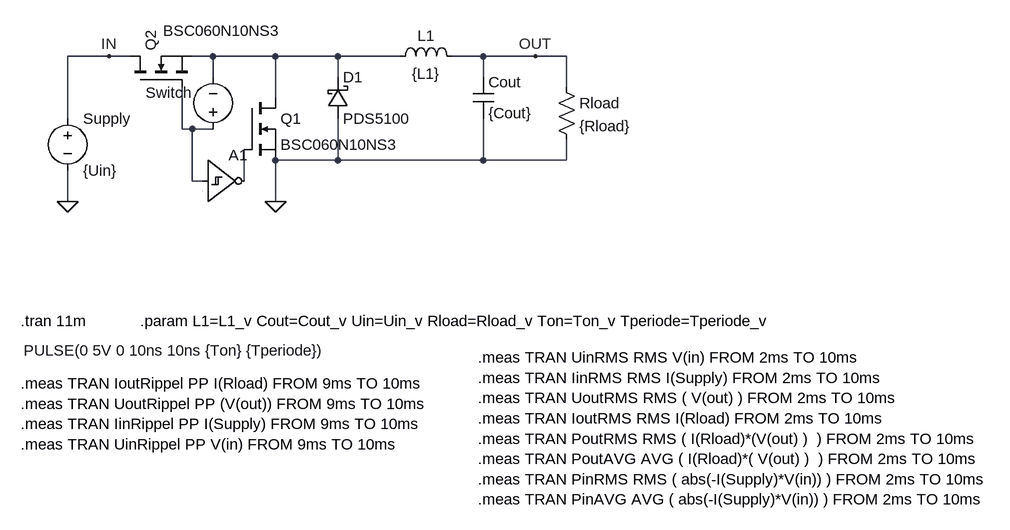
[diagram p0: schematic BuckSyncVariable.asc]
BuckSyncVariable.asc, the LTspice schematic file:
Version 4
SHEET 1 2836 1464
WIRE 400 368 336 368
WIRE 432 368 400 368
WIRE 560 368 528 368
WIRE 656 368 560 368
WIRE 752 368 656 368
WIRE 848 368 752 368
WIRE 976 368 928 368
WIRE 1056 368 976 368
WIRE 1104 368 1056 368
WIRE 560 400 560 368
WIRE 752 400 752 368
WIRE 976 400 976 368
WIRE 1104 416 1104 368
WIRE 656 432 656 368
WIRE 336 464 336 368
WIRE 512 480 512 416
WIRE 528 480 512 480
WIRE 560 480 528 480
WIRE 752 528 752 464
WIRE 752 528 656 528
WIRE 976 528 976 464
WIRE 976 528 752 528
WIRE 1104 528 1104 496
WIRE 1104 528 976 528
WIRE 528 560 528 480
WIRE 544 560 528 560
WIRE 608 560 608 512
WIRE 336 592 336 544
WIRE 656 592 656 528
FLAG 1056 368 OUT
FLAG 400 368 IN
FLAG 656 592 0
FLAG 336 592 0
SYMBOL nmos 608 432 R0
SYMATTR InstName Q1
SYMATTR Value BSC060N10NS3
SYMBOL ind 832 384 R270
WINDOW 0 32 56 VTop 2
WINDOW 3 5 56 VBottom 2
SYMATTR InstName L1
SYMATTR Value {L1}
SYMATTR SpiceLine Ipk=16.7 Rser=0.0187 Rpar=3108.6 Cpar=0
SYMBOL schottky 736 464 M180
WINDOW 0 24 64 Left 2
WINDOW 3 24 0 Left 2
SYMATTR InstName D1
SYMATTR Value PDS5100
SYMATTR Description Diode
SYMATTR Type diode
SYMBOL cap 960 400 R0
SYMATTR SpiceLine Rser=0.004
SYMATTR Value {Cout}
SYMATTR InstName Cout
SYMBOL res 1088 400 R0
SYMATTR InstName Rload
SYMATTR Value {Rload}
SYMBOL voltage 336 448 R0
WINDOW 123 0 0 Left 2
WINDOW 39 0 0 Left 2
SYMATTR InstName Supply
SYMATTR Value {Uin}
SYMBOL voltage 560 496 R180
WINDOW 123 0 0 Left 2
WINDOW 39 0 0 Left 2
WINDOW 3 -176 -325 Left 2
WINDOW 0 33 72 Left 2
SYMATTR Value PULSE(0 5V 0 10ns 10ns {Ton} {Tperiode})
SYMATTR InstName Switch
SYMBOL nmos 432 416 R270
WINDOW 3 87 51 VRight 2
SYMATTR Value BSC060N10NS3
SYMATTR InstName Q2
SYMBOL Digital\\schmtinv 544 496 R0
SYMATTR InstName A1
TEXT 968 832 Left 2 !.meas TRAN UinRMS RMS V(in) FROM 2ms TO 10ms\n.meas TRAN IinRMS RMS I(Supply) FROM 2ms TO 10ms\n.meas TRAN UoutRMS RMS ( V(out) ) FROM 2ms TO 10ms\n.meas TRAN IoutRMS RMS I(Rload) FROM 2ms TO 10ms\n.meas TRAN PoutRMS RMS ( I(Rload)*(V(out) )  ) FROM 2ms TO 10ms\n.meas TRAN PoutAVG AVG ( I(Rload)*( V(out) )  ) FROM 2ms TO 10ms\n.meas TRAN PinRMS RMS ( abs(-I(Supply)*V(in)) ) FROM 2ms TO 10ms\n.meas TRAN PinAVG AVG ( abs(-I(Supply)*V(in)) ) FROM 2ms TO 10ms
TEXT 264 872 Left 2 !.meas TRAN IoutRippel PP I(Rload) FROM 9ms TO 10ms\n.meas TRAN UoutRippel PP (V(out)) FROM 9ms TO 10ms\n.meas TRAN IinRippel PP I(Supply) FROM 9ms TO 10ms\n.meas TRAN UinRippel PP V(in) FROM 9ms TO 10ms
TEXT 448 776 Left 2 !.param L1=L1_v Cout=Cout_v Uin=Uin_v Rload=Rload_v Ton=Ton_v Tperiode=Tperiode_v
TEXT 264 776 Left 2 !.tran 11m

The netlist it stands for:
* BuckSyncVariable.asc
M§Q1 N001 N003 0 0 BSC060N10NS3
L1 N001 OUT {L1} Ipk=16.7 Rser=0.0187 Rpar=3108.6 Cpar=0
D1 0 N001 PDS5100
Cout OUT 0 {Cout} Rser=0.004
Rload OUT 0 {Rload}
V§Supply IN 0 {Uin}
V§Switch N002 N001 PULSE(0 5V 0 10ns 10ns {Ton} {Tperiode})
M§Q2 IN N002 N001 N001 BSC060N10NS3
A1 N002 0 0 0 0 N003 0 0 SCHMITT
.model D D
.lib standard.dio
.model NMOS NMOS
.model PMOS PMOS
.lib standard.mos
.meas TRAN UinRMS RMS V(in) FROM 2ms TO 10ms
.meas TRAN IinRMS RMS I(Supply) FROM 2ms TO 10ms
.meas TRAN UoutRMS RMS ( V(out) ) FROM 2ms TO 10ms
.meas TRAN IoutRMS RMS I(Rload) FROM 2ms TO 10ms
.meas TRAN PoutRMS RMS ( I(Rload)*(V(out) )  ) FROM 2ms TO 10ms
.meas TRAN PoutAVG AVG ( I(Rload)*( V(out) )  ) FROM 2ms TO 10ms
.meas TRAN PinRMS RMS ( abs(-I(Supply)*V(in)) ) FROM 2ms TO 10ms
.meas TRAN PinAVG AVG ( abs(-I(Supply)*V(in)) ) FROM 2ms TO 10ms
.meas TRAN IoutRippel PP I(Rload) FROM 9ms TO 10ms
.meas TRAN UoutRippel PP (V(out)) FROM 9ms TO 10ms
.meas TRAN IinRippel PP I(Supply) FROM 9ms TO 10ms
.meas TRAN UinRippel PP V(in) FROM 9ms TO 10ms
.param L1=L1_v Cout=Cout_v Uin=Uin_v Rload=Rload_v Ton=Ton_v Tperiode=Tperiode_v
.tran 11m
.backanno
.end